# Altium project adc08200.PrjPcb
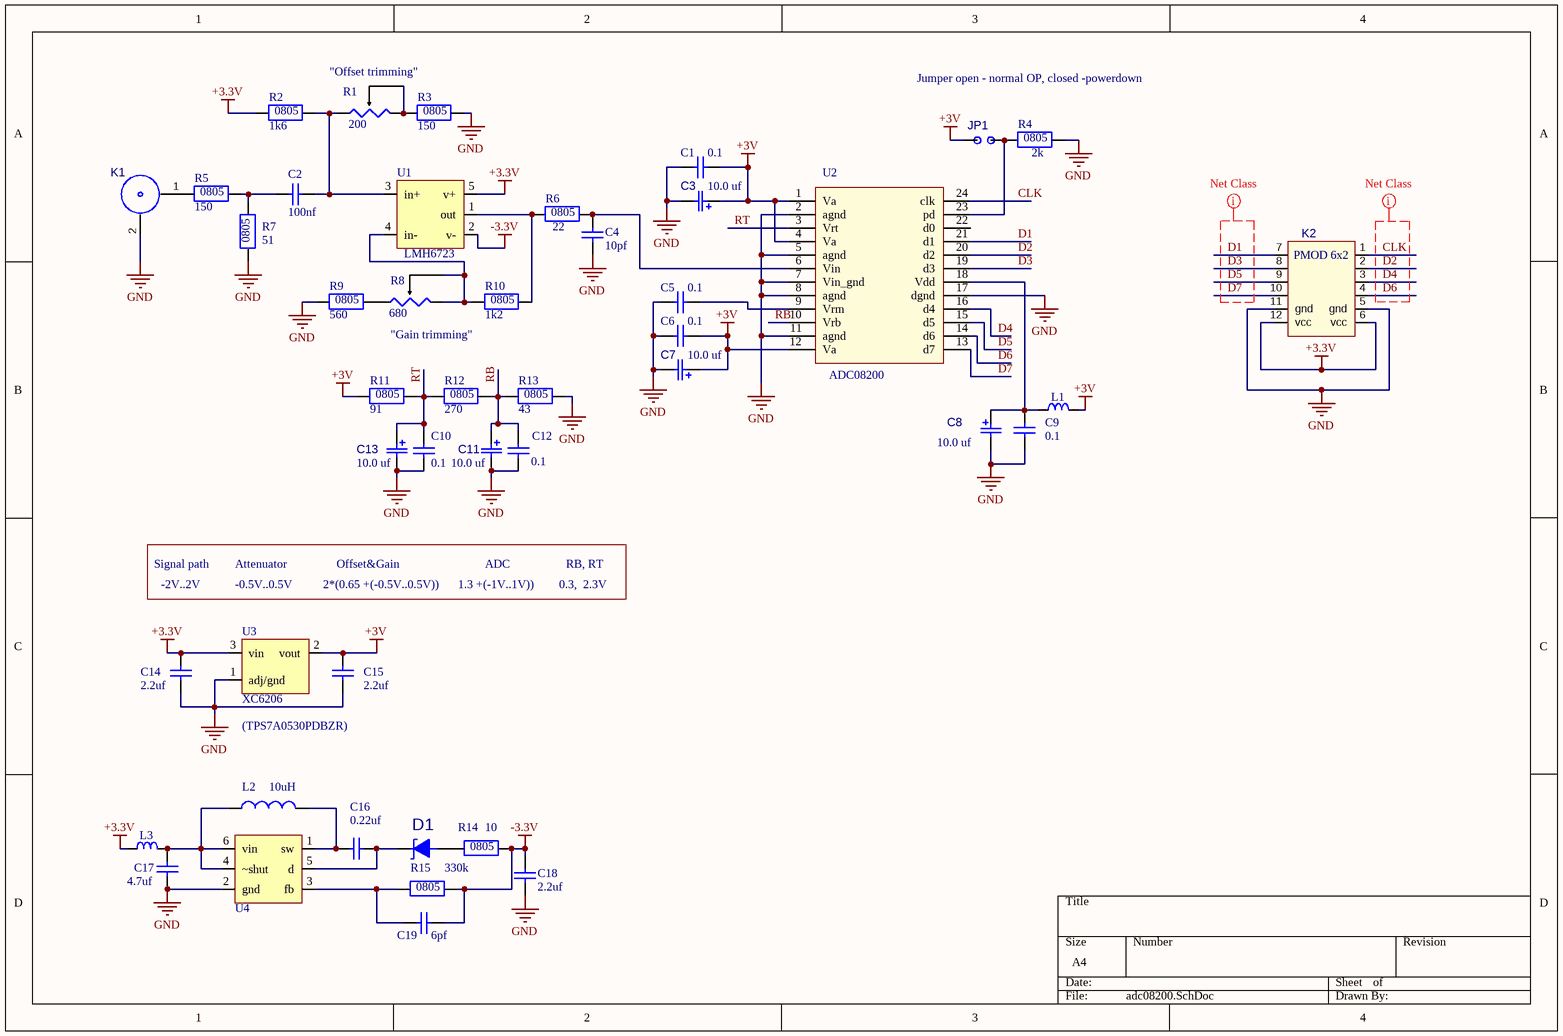
[diagram p0: adc08200.SchDoc]
1 sheet, 45 parts. Net scope: global (net labels, ports and power ports of the same name join across sheets).
Board file: adc08200.PcbDoc

## Sheet adc08200.SchDoc
size A4

### Parts
C1  value 0.1  [SM0805]  (hidden comment: cap0805)
C2  value 100nf  [SM0805]  (hidden comment: cap0805)
C3  CAP_POL_SMA  [CAP_POL_SMA (3216)]  (value not drawn)
C4  value 10pf  [SM0805]  (hidden comment: cap0805)
C5  value 0.1  [SM0805]  (hidden comment: cap0805)
C6  value 0.1  [SM0805]  (hidden comment: cap0805)
C7  CAP_POL_SMA  [CAP_POL_SMA (3216)]  (value not drawn)
C8  CAP_POL_SMA  [CAP_POL_SMA (3216)]  (value not drawn)
C9  value 0.1  [SM0805]  (hidden comment: cap0805)
C10  value 0.1  [SM0805]  (hidden comment: cap0805)
C11  CAP_POL_SMA  [CAP_POL_SMA (3216)]  (value not drawn)
C12  value 0.1  [SM0805]  (hidden comment: cap0805)
C13  CAP_POL_SMA  [CAP_POL_SMA (3216)]  (value not drawn)
C14  value 2.2uf  [SM0805]  (hidden comment: cap0805)
C15  value 2.2uf  [SM0805]  (hidden comment: cap0805)
C16  value 0.22uf  [SM0805]  (hidden comment: cap0805)
C17  value 4.7uf  [SM0805]  (hidden comment: cap0805)
C18  value 2.2uf  [SM0805]  (hidden comment: cap0805)
C19  value 6pf  [SM0805]  (hidden comment: cap0805)
D1  DiodeShottky_SOD323  [SOD323]  (value not drawn)
JP1  JUMPER2  [JUMPER2]  (value not drawn)
K1  SMA_Edge  [AMPHENOL_132357-11]  (value not drawn)
K2  PMOD_6x2_right_angle  [PMOD_6x2_right_ANGLE]  (value not drawn)
L1  75R@100MHz  [SM_0805_INDUCTANCE _3D]  (value not drawn)
L2  inductance SMT 3.2x4.5 mm  [inductor_LQH43PN]  (value not drawn)
L3  75R@100MHz  [SM_0805_INDUCTANCE _3D]  (value not drawn)
R1  value 200  [TRIM_BOURNS_3223W]  (hidden comment: res_var_SMT)
R2  value 1k6  [SM0805]  (hidden comment: res0805_EU)
R3  value 150  [SM0805]  (hidden comment: res0805_EU)
R4  value 2k  [SM0805]  (hidden comment: res0805_EU)
R5  value 150  [SM0805]  (hidden comment: res0805_EU)
R6  value 22  [SM0805]  (hidden comment: res0805_EU)
R7  value 51  [SM0805]  (hidden comment: res0805_EU)
R8  value 680  [TRIM_BOURNS_3223W]  (hidden comment: res_var_SMT)
R9  value 560  [SM0805]  (hidden comment: res0805_EU)
R10  value 1k2  [SM0805]  (hidden comment: res0805_EU)
R11  value 91  [SM0805]  (hidden comment: res0805_EU)
R12  value 270  [SM0805]  (hidden comment: res0805_EU)
R13  value 43  [SM0805]  (hidden comment: res0805_EU)
R14  value 10  [SM0805]  (hidden comment: res0805_EU)
R15  value 330k  [SM0805]  (hidden comment: res0805_EU)
U1  LMH6723  [SOT-23_5]
U2  ADC08200  [SSOP-24]
U3  XC6206  [SOT-23]
U4  LT3483  [SOT-23_6]  (value not drawn)

### Nets
+3.3V: C14.2 K2.6(vcc) K2.12(vcc) L3.1 R2.1 U1.5(v+) U3.3(vin)
+3V: C1.2 C3.1(a) C6.2 C7.1(a) C15.2 JP1.2 L1.2 R11.1 U2.1(Va) U2.4(Va) U2.12(Va) U3.2(vout)
-3.3V: C18.2 C19.1 R14.2 R15.2 U1.2(v-)
GND: C1.1 C3.2(b) C4.1 C5.1 C6.1 C7.2(b) C8.2(b) C9.1 C10.1 C11.2(b) C12.1 C13.2(b) C14.1 C15.1 C17.1 C18.1 K1.2 K2.5(gnd) K2.11(gnd) R3.2 R4.2 R7.1 R9.1 R13.2 U2.2(agnd) U2.5(agnd) U2.7(Vin_gnd) U2.8(agnd) U2.11(agnd) U2.17(dgnd) U3.1(adj/gnd) U4.2(gnd)
CLK: K2.1 U2.24(clk)
D1: K2.7 U2.21(d1)
D2: K2.2 U2.20(d2)
D3: K2.8 U2.19(d3)
D4: K2.3 U2.16(d4)
D5: K2.9 U2.15(d5)
D6: K2.4 U2.14(d6)
D7: K2.10 U2.13(d7)
RB: C11.1(a) C12.2 R12.2 R13.1 U2.10(Vrb)
RT: C10.2 C13.1(a) R11.2 R12.1 U2.3(Vrt)
NetC2_1: C2.1 R5.2 R7.2
NetC2_2: C2.2 R1.1 R2.2 U1.3(in+)
NetC4_2: C4.2 R6.2 U2.6(Vin)
NetC5_2: C5.2 U2.9(Vrm)
NetC8_1: C8.1(a) C9.2 L1.1 U2.18(Vdd)
NetC16_1: C16.1 D1.2(k) U4.5(d)
NetC16_2: C16.2 L2.2 U4.1(sw)
NetC17_2: C17.2 L2.1 L3.2 U4.4(~shut) U4.6(vin)
NetC19_2: C19.2 R15.1 U4.3(fb)
NetD1_1: D1.1(a) R14.1
NetJP1_1: JP1.1 R4.1 U2.23(pd)
NetK1_1: K1.1 R5.1
NetR1_2: R1.2 R1.3 R3.1
NetR6_1: R6.1 R10.2 U1.1(out)
NetR8_1: R8.1 R9.2
NetR8_2: R8.2 R8.3 R10.1 U1.4(in-)

Not connected (* = marked no-connect by the designer): U2 22(d0)

### Layout directives
net class data: CLK, D1, D2, D3, D4, D5, D6, D7

### Notes on the sheet
- (near R1) "Offset trimming"
- Jumper open - normal OP, closed -powerdown
- "Gain trimming"
- Signal path
- Attenuator
- Offset&Gain
- ADC
- RB, RT
- -2V..2V
- -0.5V..0.5V
- 2*(0.65 +(-0.5V..0.5V))
- 1.3 +(-1V..1V))
- 0.3,  2.3V
- (TPS7A0530PDBZR)
- (in symbol CAP_POL_SMA) 10.0 uf
- (in symbol inductor_LQH43PN) 10uH
- (in symbol PMOD_6x2_right_angle) PMOD 6x2
- (in symbol res0805_EU) 0805

### Library data of the parts
C1 C2 C4-C6 C9 C10 C12 C14-C19 = cap0805: Capacitor; Published: 8-Jun-2000; LatestRevisionDate: 17-Jul-2002; LatestRevisionNote: Re-released for DXP Platform.; PackageReference: RAD-0.3; Publisher: Altium Limited; PackageDescription: Radial Cap, Thru-Hole; 2 Leads; 0.3 in Pin Spacing
C3 C7 C8 C11 C13 = CAP_POL_SMA: CAP_POL_SMA(3216)
D1 = DiodeShottky_SOD323: SOD323
L1 L3 = Ind_Chip_0805: chip inductance; Part Number: IND0805_MURATA_BLM21BB750SN1D; Part Description: SMD EMIFIL Suppression Chip Ferrite Bead; Manufacturer: MURATA; Manufacturer Part Number: BLM21BB750SN1D; Power: 700mA; Resistance: 0.16R; Tolerance: ±25%; Table: Inductors SMD; Component Kind: Standard; Component Type: Standard; Footprint: INDC2012X105N; Pin Count: 2; Value: 75R@100MHz; Status: None; Case: 0805; Mounted: Yes; Socket: No; SMD: Yes; ComponentHeight: 1.05mm; Author: S. Jafar; CreateDate: 12/21/2015; LatestRevisionDate: 12/21/2015
L2 = inductor_LQH43PN
R1 R8 = res_var_SMT: Trimmer  Bourns  3223W; Published: 8-Jun-2000; LatestRevisionDate: 29-May-2009; LatestRevisionNote: IPC-7351 Footprint Added.; PackageReference: J1-0603; Publisher: Altium Limited; PackageDescription: Chip Resistor
R2-R7 R9-R15 = res0805_EU: Resistor; Published: 8-Jun-2000; LatestRevisionDate: 29-May-2009; LatestRevisionNote: IPC-7351 Footprint Added.; PackageReference: J1-0603; Publisher: Altium Limited; PackageDescription: Chip Resistor
U1 = LMH6723: current feedback OPAMP
U2 = ADC08200: soic28 with thermalpad
U3 = XC6206: SOT-23-3 ldo
U4 = LT3483: dc/dc tsot23-6
JP1 = JUMPER2: Value: *
K1 = SMA_Edge: Value: *
K2 = PMOD_6x2_right_angle: Value: *